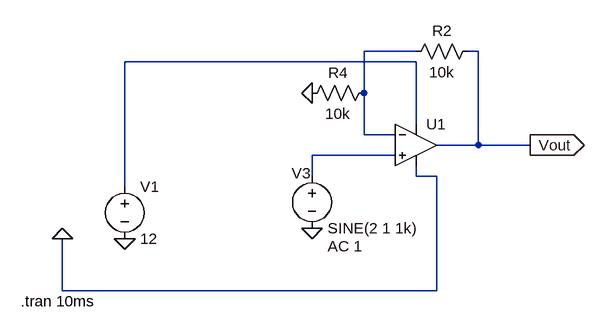
[diagram p0: schematic non-inverting-opamp.asc]
non-inverting-opamp.asc, the LTspice schematic file:
Version 4
SHEET 1 880 680
WIRE 272 -16 192 -16
WIRE 368 -16 352 -16
WIRE 272 0 -176 0
WIRE 192 48 192 -16
WIRE 272 96 272 0
WIRE 192 112 192 48
WIRE 240 112 192 112
WIRE 368 128 368 -16
WIRE 368 128 304 128
WIRE 448 128 368 128
WIRE 240 144 112 144
WIRE 112 176 112 144
WIRE 272 176 272 160
WIRE 304 176 272 176
WIRE -176 192 -176 0
WIRE -272 352 -272 272
WIRE 304 352 304 176
WIRE 304 352 -272 352
FLAG -176 272 0
FLAG -272 272 0
FLAG 112 256 0
FLAG 112 48 0
FLAG 448 128 Vout
IOPIN 448 128 Out
SYMBOL voltage -176 176 R0
SYMATTR InstName V1
SYMATTR Value 12
SYMBOL voltage 112 160 R0
WINDOW 0 -31 11 Left 2
WINDOW 123 24 124 Left 2
WINDOW 39 0 0 Left 0
SYMATTR InstName V3
SYMATTR Value SINE(2 1 1k)
SYMATTR Value2 AC 1
SYMBOL res 368 -32 R90
WINDOW 0 0 56 VBottom 2
WINDOW 3 32 56 VTop 2
SYMATTR InstName R2
SYMATTR Value 10k
SYMBOL res 208 32 R90
WINDOW 0 0 56 VBottom 2
WINDOW 3 32 56 VTop 2
SYMATTR InstName R4
SYMATTR Value 10k
SYMBOL OpAmps\\UniversalOpAmp 272 128 R0
SYMATTR InstName U1
TEXT -336 368 Left 2 !.tran 10ms

The netlist it stands for:
* non-inverting-opamp.asc
V1 N002 0 12
V3 N003 0 SINE(2 1 1k) AC 1
R2 Vout N001 10k
R4 N001 0 10k
XU1 N003 N001 N002 0 Vout level1 Avol=1Meg GBW=10Meg Vos=0 En=0 Enk=0 In=0 Ink=0 Rin=500Meg  ; pins In+ In- V+ V- OUT
.tran 10ms
.lib UniversalOpAmp1.lib
.backanno
.end